# Altium schematic sheet ad3.SchDoc
size A2
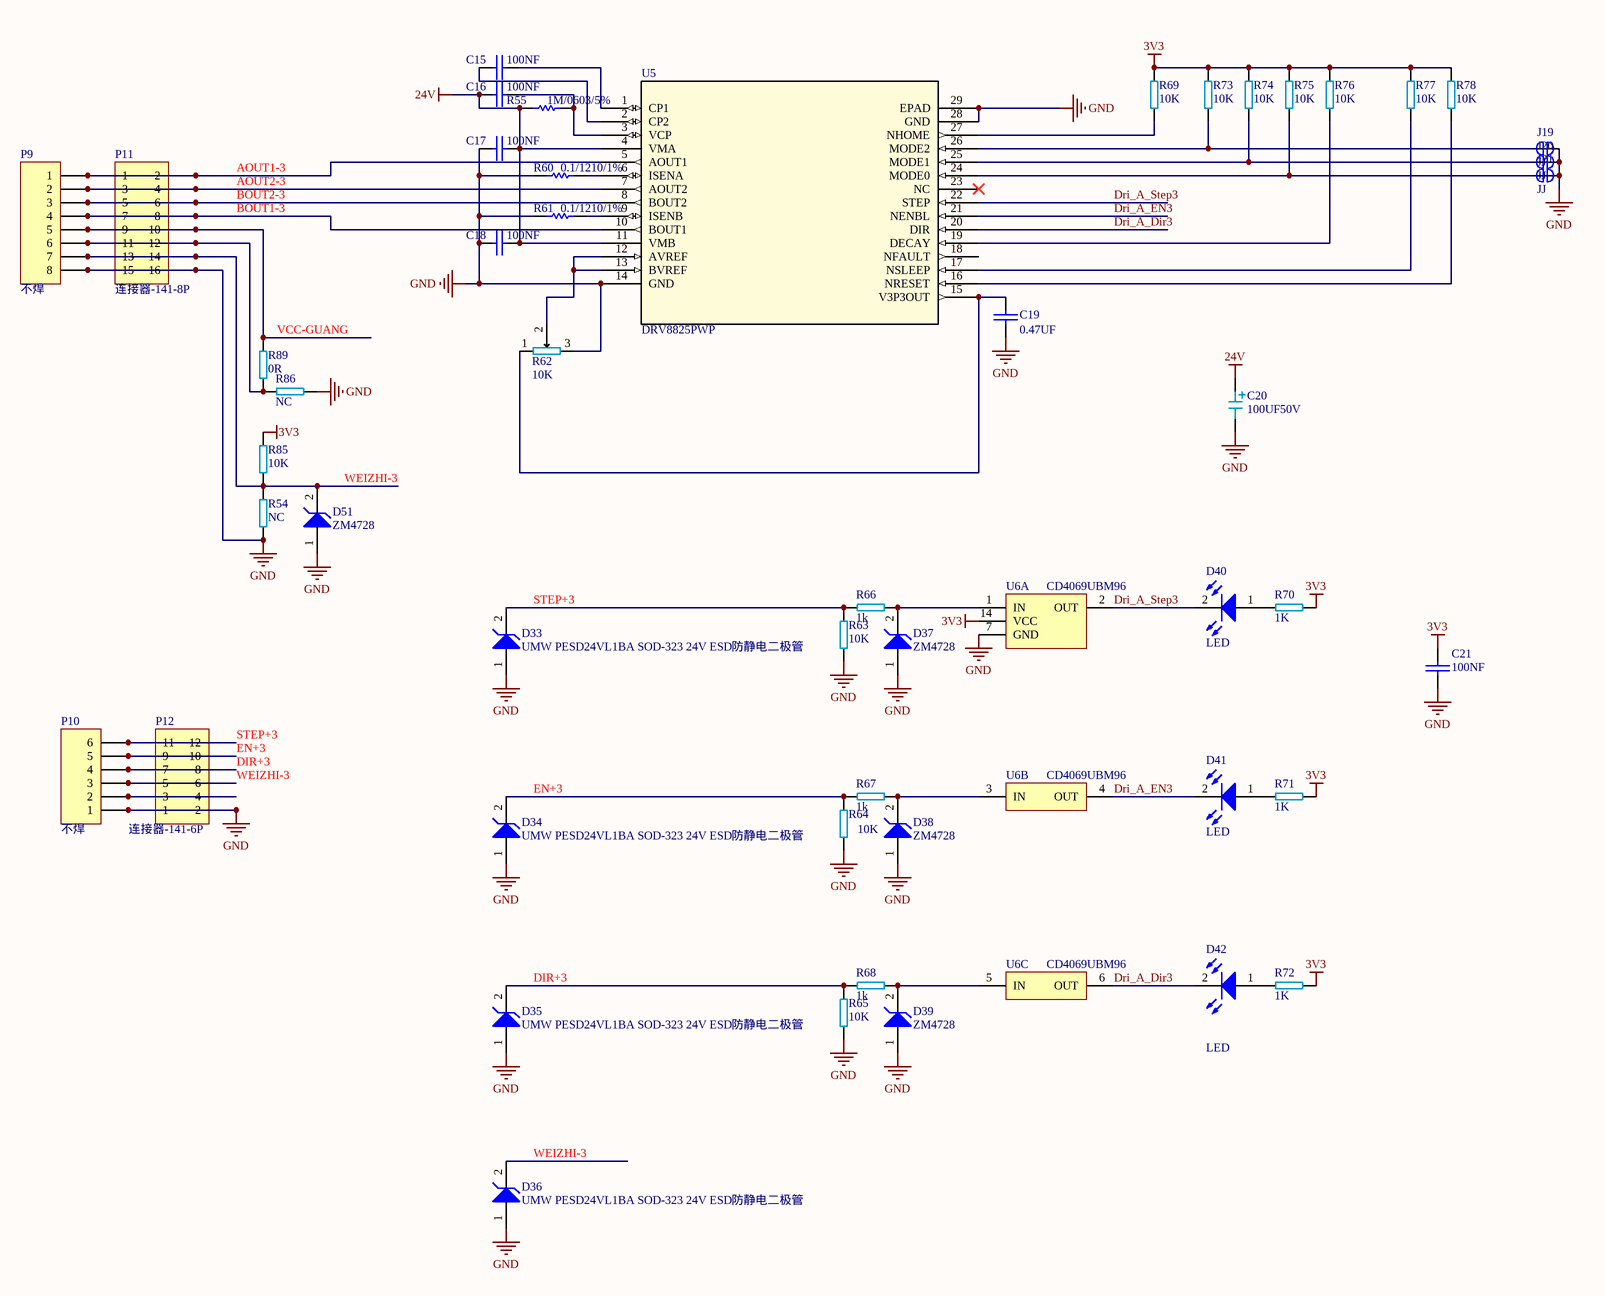
[diagram p0: ad3.SchDoc]

## Parts
C15  100NF  [C0603]
C16  100NF  [C0603]
C17  100NF  [C0603]
C18  100NF  [C0603]
C19  0.47UF  [C0603]
C20  100UF50V  [CE8]
C21  100NF  [C0603]
D33  UMW PESD24VL1BA SOD-323 24V ESD防静电二极管  [SOD323]
D34  UMW PESD24VL1BA SOD-323 24V ESD防静电二极管  [SOD323]
D35  UMW PESD24VL1BA SOD-323 24V ESD防静电二极管  [SOD323]
D36  UMW PESD24VL1BA SOD-323 24V ESD防静电二极管  [SOD323]
D37  ZM4728  [D1206]
D38  ZM4728  [D1206]
D39  ZM4728  [D1206]
D40  LED  [LED0603]
D41  LED  [LED0603]
D42  LED  [LED0603]
D51  ZM4728  [D1206]
J19  JJ  [TIAOXIAN-PAN]
J20  JJ  [TIAOXIAN-PAN]
J21  JJ  [TIAOXIAN-PAN]
P9  不焊  [SIP8]
P10  不焊  [SIP6]
P11  连接器-141-8P  [141V-8P]
P12  连接器-141-6P  [141V-6P]
R54  NC  [R0603]
R55  1M/0603/5%  [R0603]
R60  0.1/1210/1%  [R1210]
R61  0.1/1210/1%  [R1210]
R62  10K  [RR-MINI-SMD]
R63  10K  [R0603]
R64  10K  [R0603]
R65  10K  [R0603]
R66  1k  [R0603]
R67  1k  [R0603]
R68  1k  [R0603]
R69  10K  [R0603]
R70  1K  [R0603]
R71  1K  [R0603]
R72  1K  [R0603]
R73  10K  [R0603]
R74  10K  [R0603]
R75  10K  [R0603]
R76  10K  [R0603]
R77  10K  [R0603]
R78  10K  [R0603]
R85  10K  [R0603]
R86  NC  [R0603]
R89  0R  [R0603]
U5  DRV8825PWP  [HTSSOP28]
U6  CD4069UBM96  [SO14]  (parts A,B,C of 6)

## Nets
3V3: C21.2 R69.2 R70.2 R71.2 R72.2 R73.2 R74.2 R75.2 R76.2 R77.2 R78.2 R85.2 U6.14(VCC)
24V: C16.1 C17.2 C18.2 C20.1 R55.2 U5.4(VMA) U5.11(VMB)
GND: C17.1 C18.1 C19.1 C20.2 C21.1 D33.1 D34.1 D35.1 D36.1 D37.1 D38.1 D39.1 D51.1 J19.2 J20.2 J21.2 P9.8 P10.1 P11.15 P11.16 P12.1 P12.2 R54.1 R60.2 R61.2 R62.3 R63.1 R64.1 R65.1 R86.1 U5.14(GND) U5.28(GND) U5.29(EPAD) U6.7(GND)
AOUT1-3: P9.1 P11.1 P11.2 U5.5(AOUT1)
AOUT2-3: P9.2 P11.3 P11.4 U5.7(AOUT2)
BOUT1-3: P9.4 P11.7 P11.8 U5.10(BOUT1)
BOUT2-3: P9.3 P11.5 P11.6 U5.8(BOUT2)
DIR+3: D35.2 P10.4 P12.7 P12.8 R65.2 R68.2
Dri_A_Dir3: D42.2(K) U5.20(DIR) U6.6(OUT)
Dri_A_EN3: D41.2(K) U5.21(NENBL) U6.4(OUT)
Dri_A_Step3: D40.2(K) U5.22(STEP) U6.2(OUT)
EN+3: D34.2 P10.5 P12.9 P12.10 R64.2 R67.2
STEP+3: D33.2 P10.6 P12.11 P12.12 R63.2 R66.2
VCC-GUANG: P9.5 P11.9 P11.10 R89.2
WEIZHI-3: D36.2 D51.2 P9.7 P10.3 P11.13 P11.14 P12.5 P12.6 R54.2 R85.1
NetC15_1: C15.1 U5.2(CP2)
NetC15_2: C15.2 U5.1(CP1)
NetC16_2: C16.2 R55.1 U5.3(VCP)
NetC19_2: C19.2 R62.1 U5.15(V3P3OUT)
NetD37_2: D37.2 R66.1 U6.1(IN)
NetD38_2: D38.2 R67.1 U6.3(IN)
NetD39_2: D39.2 R68.1 U6.5(IN)
NetD40_1: D40.1(A) R70.1
NetD41_1: D41.1(A) R71.1
NetD42_1: D42.1(A) R72.1
NetJ19_1: J19.1 R73.1 U5.26(MODE2)
NetJ20_1: J20.1 R74.1 U5.25(MODE1)
NetJ21_1: J21.1 R75.1 U5.24(MODE0)
NetP9_6: P9.6 P11.11 P11.12 R86.2 R89.1
NetP10_2: P10.2 P12.3 P12.4
NetR60_1: R60.1 U5.6(ISENA)
NetR61_1: R61.1 U5.9(ISENB)
NetR62_2: R62.2 U5.12(AVREF) U5.13(BVREF)
NetR69_1: R69.1 U5.27(NHOME)
NetR76_1: R76.1 U5.19(DECAY)
NetR77_1: R77.1 U5.17(NSLEEP)
NetR78_1: R78.1 U5.16(NRESET)

Not connected (* = marked no-connect by the designer): U5 18(NFAULT) 23(NC)*

## Library data of the parts
C15-C19 C21 = CAP: Capacitor
C20 = C+: 铝电解电容
D33-D39 D51 = TVS-SMA: 稳压管; Published: 8-Jun-2000; LatestRevisionDate: 17-Jul-2002; LatestRevisionNote: Re-released for DXP Platform.; DatasheetVersion: 1997; PackageReference: DO-35; Publisher: Altium Limited; PackageDescription: Diode, Axial; Body 3.8 x 1.9 mm (LxDia. max), Lead Dia. 0.53 mm (max); Code_JEDEC: DO-204-AH; ComponentLink1Description: Manufacturer Link; ComponentLink1URL: http://www.fairchildsemi.com/; ComponentLink2Description: Datasheet; ComponentLink2URL: http://www.fairchildsemi.com/ds/1N%2F1N4448.pdf
D40-D42 = LED0603: Published: 8-Jun-2000; LatestRevisionDate: 08-Jul-2005; LatestRevisionNote: Mech Layer 1 removed.; PackageReference: LED-0; Publisher: Altium Limited; PackageDescription: LED; 2 Leads
J19-J21 = JJ: 跳线
P9 = SIP8: 连接器; LatestRevisionDate: 17-Jul-2002; LatestRevisionNote: Re-released for DXP Platform.; Publisher: Altium Limited
P10 = SIP6: 连接器; LatestRevisionDate: 17-Jul-2002; LatestRevisionNote: Re-released for DXP Platform.; Publisher: Altium Limited
P11 = DIC16: 连接器; LatestRevisionDate: 17-Jul-2002; LatestRevisionNote: Re-released for DXP Platform.; Publisher: Altium Limited
P12 = DIC12: 连接器; LatestRevisionDate: 17-Jul-2002; LatestRevisionNote: Re-released for DXP Platform.; Publisher: Altium Limited
R54 R63-R78 R85 R86 R89 = R-0603: 贴片电阻
R55 R60 R61 = Res1: Resistor; Value: 1K; Published: 8-Jun-2000; LatestRevisionDate: 17-Jul-2002; LatestRevisionNote: Re-released for DXP Platform.; PackageReference: AXIAL-0.3; Publisher: Altium Limited; PackageDescription: Axial Device, Thru-Hole; 2 Leads; 0.3 in Pin Spacing
R62 = RR: 电位器
U5 = DRV8825PWP: 芯片
U6 = CD4069: 芯片